# Altium schematic sheet 03_RFID.SchDoc
size A4
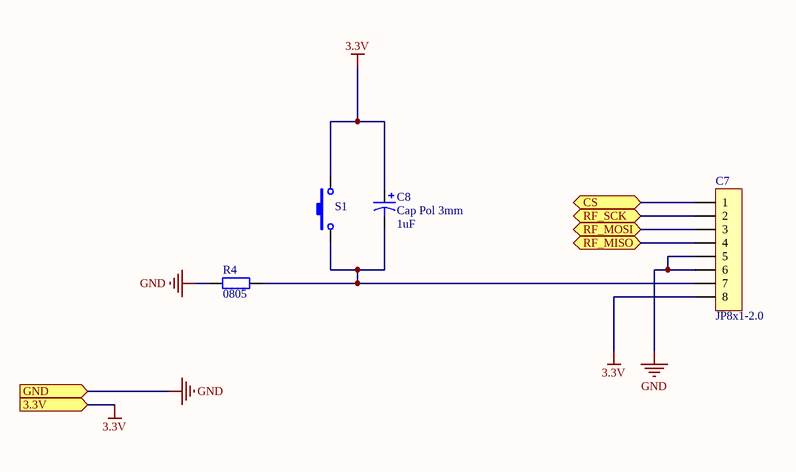
[diagram p0: 03_RFID.SchDoc]

## Parts
C7  JP8x1-2.0  [J8-C1T]
C8  Cap Pol 3mm  [C3MM]
R4  value 0805  [DIEN TRO 0805]  (hidden comment: R0805)
S1  SW-SMD  [SW-SMD]  (value not drawn)

## Ports
3.3V (in), CS (bidir), GND (in), RF_MISO (bidir), RF_MOSI (bidir), RF_SCK (bidir)

## Nets
3.3V: C7.8 C8.1 S1.2 ; port 3.3V
GND: C7.5 C7.6 R4.1 ; port GND
CS: C7.1 ; port CS
RF_MISO: C7.4 ; port RF_MISO
RF_MOSI: C7.3 ; port RF_MOSI
RF_SCK: C7.2 ; port RF_SCK
NetC7_7: C7.7 C8.2 R4.2 S1.1

## Notes on the sheet
- Project:
- MANDevices
- Page Contents:
- Size:
- Date:
- A4
- Checked by:
- Time:
- Revision:
- Sheet
- of
- HaNoi University of
- Science and Technology
- File:
- (in symbol Cap Pol 3mm) 1uF

## Library data of the parts
C7 = JP8x1-2.0: WR-PHD 2.00 mm Socket Header; Manufacturer: W¨¹rth Elektronik eiSos GmbH; partNo: 62000811821; ComponentLink1 Description: Manufacturer; ComponentLink2 Description: Datasheet; NoPins: 08; Created Date: 2 April 2013; ComponentLink1URL: http://www.we-online.com; ComponentLink2URL: http://katalog.we-online.de/em/datasheet/6200xx11821.pdf; Created by: Karrer Zheng
C8 = Cap Pol 3mm: Polarized Capacitor (Axial); Published: 8-Jun-2000; LatestRevisionDate: 17-Jul-2002; LatestRevisionNote: Re-released for DXP Platform.; PackageReference: POLAR0.8; Publisher: Altium Limited
R4 = R0805: Resistor SMD 0805; Published: 8-Jun-2000; LatestRevisionDate: 17-Jul-2002; LatestRevisionNote: Re-released for DXP Platform.; PackageReference: AXIAL-0.4; Publisher: Altium Limited
S1 = SW-SMD: Switch; Published: 24-Mar-1999; LatestRevisionDate: 17-Jul-2002; LatestRevisionNote: Re-released for DXP Platform.; PackageReference: SPST-2; Publisher: Altium Limited